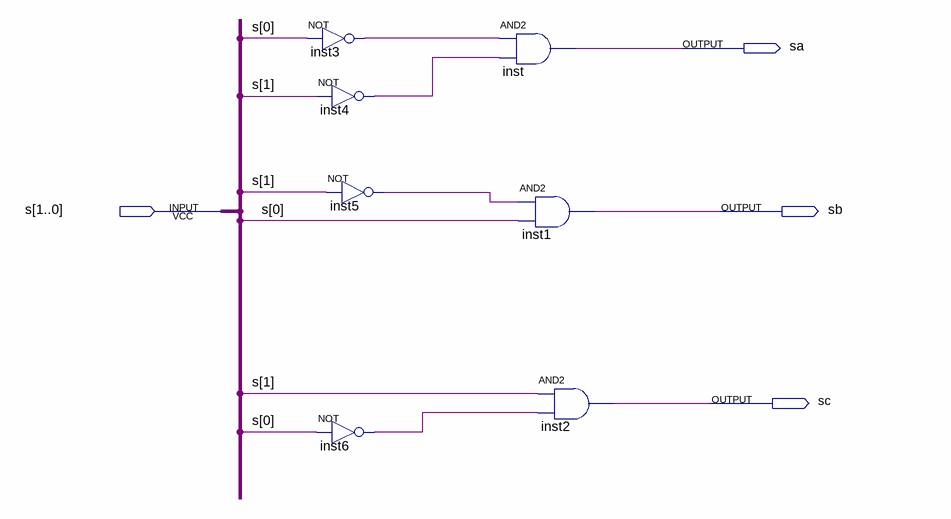
[diagram p0: schematic sheet]
// Quartus schematic destination.bdf as structural Verilog: 7 symbols, 4 pins
module destination (
  input  [1:0] s,
  output sa,
  output sb,
  output sc
);

  wire inst3_out, inst4_out, inst5_out, inst6_out;

  not inst3 (inst3_out, s[0]);
  not inst4 (inst4_out, s[1]);
  not inst5 (inst5_out, s[1]);
  not inst6 (inst6_out, s[0]);
  and inst (sa, inst3_out, inst4_out);
  and inst1 (sb, inst5_out, s[0]);
  and inst2 (sc, s[1], inst6_out);
endmodule
